# Altium schematic sheet Sheet2Error.SchDoc
size A4
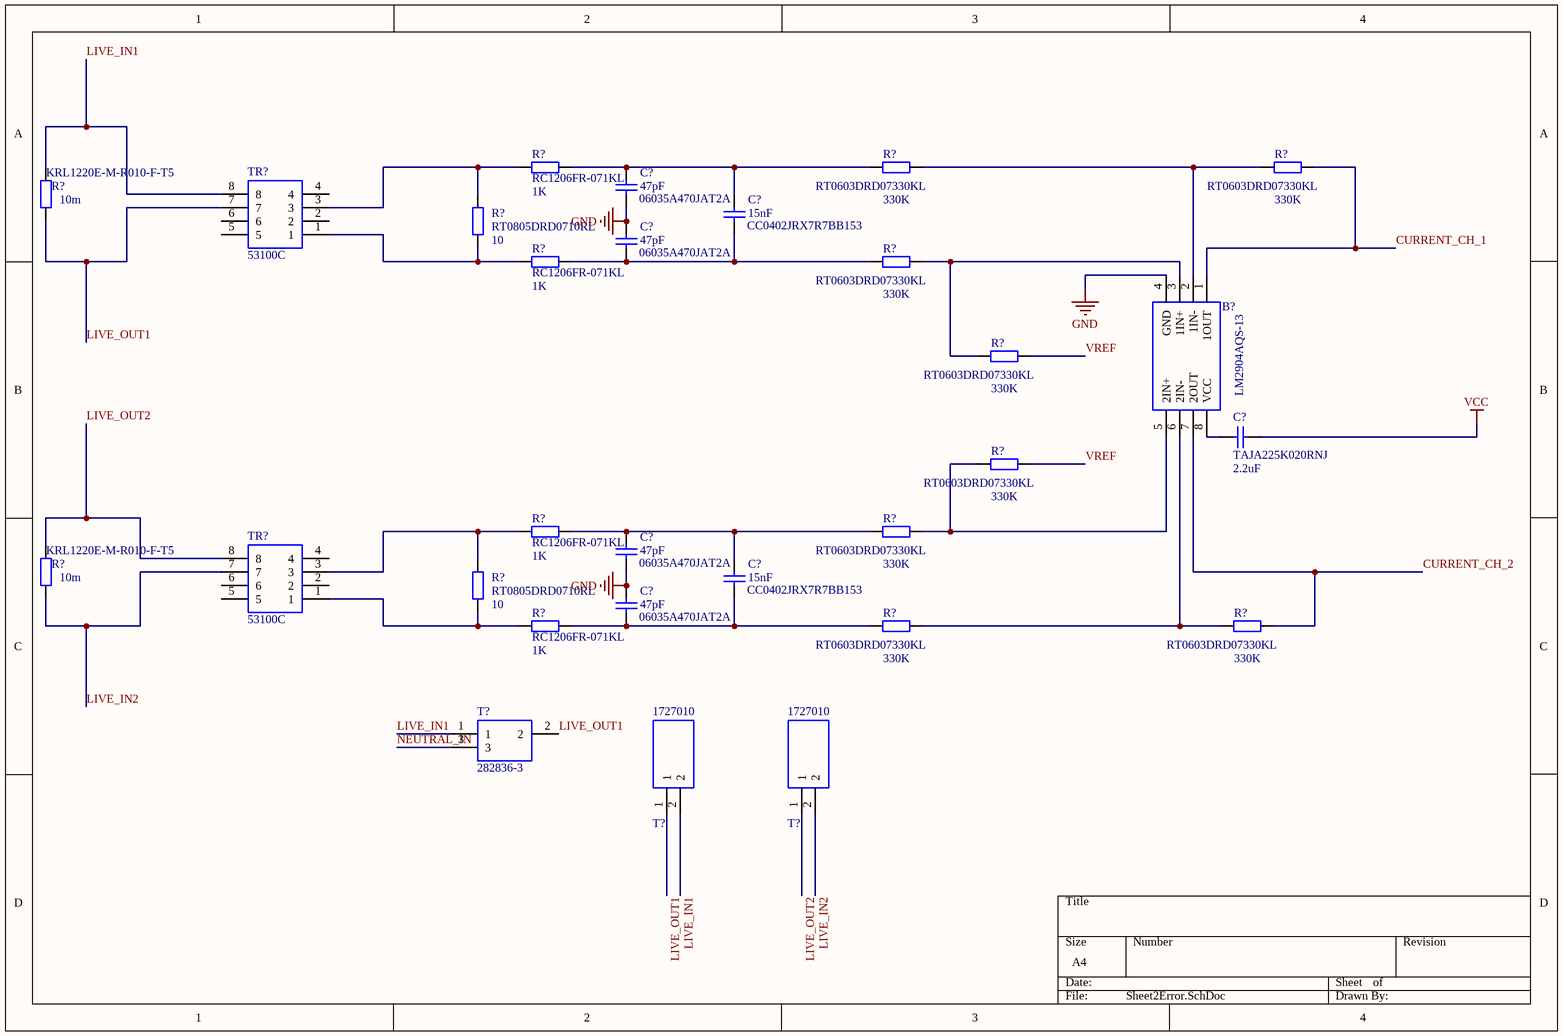
[diagram p0: Sheet2Error.SchDoc]

## Parts
(Parts that share a designator on the sheet are numbered #1, #2 ... from top to bottom, then left to right.)
B?  LM2904AQS-13  [SOIC127P600X175-8N]
C?#1  06035A470JAT2A  value 47pF  [0603-M]
C?#2  CC0402JRX7R7BB153  value 15nF  [CAPC1005X55N]
C?#3  06035A470JAT2A  value 47pF  [0603-M]
C?#4  TAJA225K020RNJ  value 2.2uF  [CAPPM3216X180N]
C?#5  06035A470JAT2A  value 47pF  [0603-M]
C?#6  CC0402JRX7R7BB153  value 15nF  [CAPC1005X55N]
C?#7  06035A470JAT2A  value 47pF  [0603-M]
R?#1  RT0603DRD07330KL  value 330K  [RC0603N-M]
R?#2  RT0603DRD07330KL  value 330K  [RC0603N-M]
R?#3  RC1206FR-071KL  value 1K  [RC1206N-M]
R?#4  KRL1220E-M-R010-F-T5  value 10m  [RES_1220-M]
R?#5  RT0805DRD0710RL  value 10  [RC0805N-M]
R?#6  RT0603DRD07330KL  value 330K  [RC0603N-M]
R?#7  RC1206FR-071KL  value 1K  [RC1206N-M]
R?#8  RT0603DRD07330KL  value 330K  [RC0603N-M]
R?#9  RT0603DRD07330KL  value 330K  [RC0603N-M]
R?#10  RT0603DRD07330KL  value 330K  [RC0603N-M]
R?#11  RC1206FR-071KL  value 1K  [RC1206N-M]
R?#12  KRL1220E-M-R010-F-T5  value 10m  [RES_1220-M]
R?#13  RT0805DRD0710RL  value 10  [RC0805N-M]
R?#14  RT0603DRD07330KL  value 330K  [RC0603N-M]
R?#15  RT0603DRD07330KL  value 330K  [RC0603N-M]
R?#16  RC1206FR-071KL  value 1K  [RC1206N-M]
T?#1  282836-3  [282836-3]
T?#2  1727010  [SHDR2W90P0X350_1X2_750X730X850P]
T?#3  1727010  [SHDR2W90P0X350_1X2_750X730X850P]
TR?#1  53100C  [53050C]
TR?#2  53100C  [53050C]

## Nets
GND: B?.4(GND) C?#1.1 C?#3.2 C?#5.1 C?#7.2
VCC: C?#4.1
CURRENT_CH_1: B?.1(1OUT) R?#2.2
CURRENT_CH_2: B?.7(2OUT) R?#15.2
LIVE_IN1: R?#4.2 T?#1.1 T?#2.2 TR?#1.8
LIVE_IN2: R?#12.1 T?#3.2 TR?#2.7
LIVE_OUT1: R?#4.1 T?#1.2 T?#2.1 TR?#1.7
LIVE_OUT2: R?#12.2 T?#3.1 TR?#2.8
NEUTRAL_IN: T?#1.3
VREF: R?#8.2 R?#9.2
NetB?_2: B?.2(1IN-) R?#1.2 R?#2.1
NetB?_3: B?.3(1IN+) R?#6.2 R?#8.1
NetB?_5: B?.5(2IN+) R?#9.1 R?#10.2
NetB?_6: B?.6(2IN-) R?#14.2 R?#15.1
NetB?_8: B?.8(VCC) C?#4.2
NetC?#1_2: C?#1.2 C?#2.2 R?#1.1 R?#3.1
NetC?#2_1: C?#2.1 C?#3.1 R?#6.1 R?#7.1
NetC?#5_2: C?#5.2 C?#6.2 R?#10.1 R?#11.1
NetC?#6_1: C?#6.1 C?#7.1 R?#14.1 R?#16.1
NetR?#3_2: R?#3.2 R?#5.2 TR?#1.3
NetR?#5_1: R?#5.1 R?#7.2 TR?#1.1
NetR?#11_2: R?#11.2 R?#13.2 TR?#2.3
NetR?#13_1: R?#13.1 R?#16.2 TR?#2.1

Not connected (* = marked no-connect by the designer): TR?#1 2 4 5 6; TR?#2 2 4 5 6

## Library data of the parts
B? = LM2904AS-13: https://www.diodes.com/assets/Datasheets/LM2902_04.pdf; Manufacturer_Name: Diodes Inc.; Geometry.Height: 1.75mm; Supplier_Name: RS; RS Part Number: *; Manufacturer_Part_Number: LM2904AS-13; Allied_Number: *; Other Part Number: *; Datasheet Link: https://www.diodes.com/assets/Datasheets/LM2902_04.pdf; 3D Package: *
C?#1-C?#7 = Cap: Capacitor; Published: 8-Jun-2000; LatestRevisionDate: 17-Jul-2002; LatestRevisionNote: Re-released for DXP Platform.; PackageReference: RAD-0.3; Publisher: Altium Limited; PackageDescription: Radial Cap, Thru-Hole; 2 Leads; 0.3 in Pin Spacing
R?#1-R?#16 = Res2: Resistor; Published: 8-Jun-2000; LatestRevisionDate: 17-Jul-2002; LatestRevisionNote: Re-released for DXP Platform.; PackageReference: AXIAL-0.4; Publisher: Altium Limited; PackageDescription: Axial Device, Thru-Hole; 2 Leads; 0.4 in Pin Spacing
T?#1 = 282836-3: 3 way PCB screw terminal,5mm pitch; Manufacturer_Name: TE Connectivity; Allied_Number: 70086276; Supplier_Name: RS; RS Part Number: 1648600; Manufacturer_Part_Number: 282836-3; Other Part Number: *; Datasheet Link: http://www.te.com/commerce/DocumentDelivery/DDEController?Action=showdoc&DocId=Catalog+Section%7F1308389_EUROSTYLE_TERMINAL_BLOCKS%7F0607%7Fpdf%7FEnglish%7FENG_CS_1308389_EUROSTYLE_TERMINAL_BLOCKS_0607.pdf%7F282836-3.pdf; 3D Package: *
T?#2 T?#3 = 1727010: 2 way vertical screw header,3.81mm pitch Phoenix Contact Non-Fused Terminal Block, 2 Way, Solder Terminals, 30 ??? 16 AWG Through Hole, Nylon, 400 V; Allied_Number: 70054357; Geometry.Height: 8.5mm; Supplier_Name: RS; RS Part Number: 1015384; Manufacturer_Name: Phoenix Contact; Manufacturer_Part_Number: 1727010; Other Part Number: *; Datasheet Link: http://docs-europe.electrocomponents.com/webdocs/13d6/0900766b813d6966.pdf; 3D Package: *
TR?#1 TR?#2 = 53050C: Current sensing transformer SMD 1:50 Murata Power Solutions 10A Surface Mount Current Transformer, 1:50; Manufacturer_Name: Murata Electronics; Allied_Number: R1031173; Supplier_Name: RS; RS Part Number: 7157021P; Manufacturer_Part_Number: 53050C; Other Part Number: *; Datasheet Link: http://docs-europe.electrocomponents.com/webdocs/0eb1/0900766b80eb1ad8.pdf; 3D Package: *